# EasyEDA Pro project GPIO_Button_Grove_MOSFET_LED.epro

# Schematic GPIO_Button_Grove_MOSFET_LED

## Sheets
1 GPIO_Push-Button_or_Switch_Input
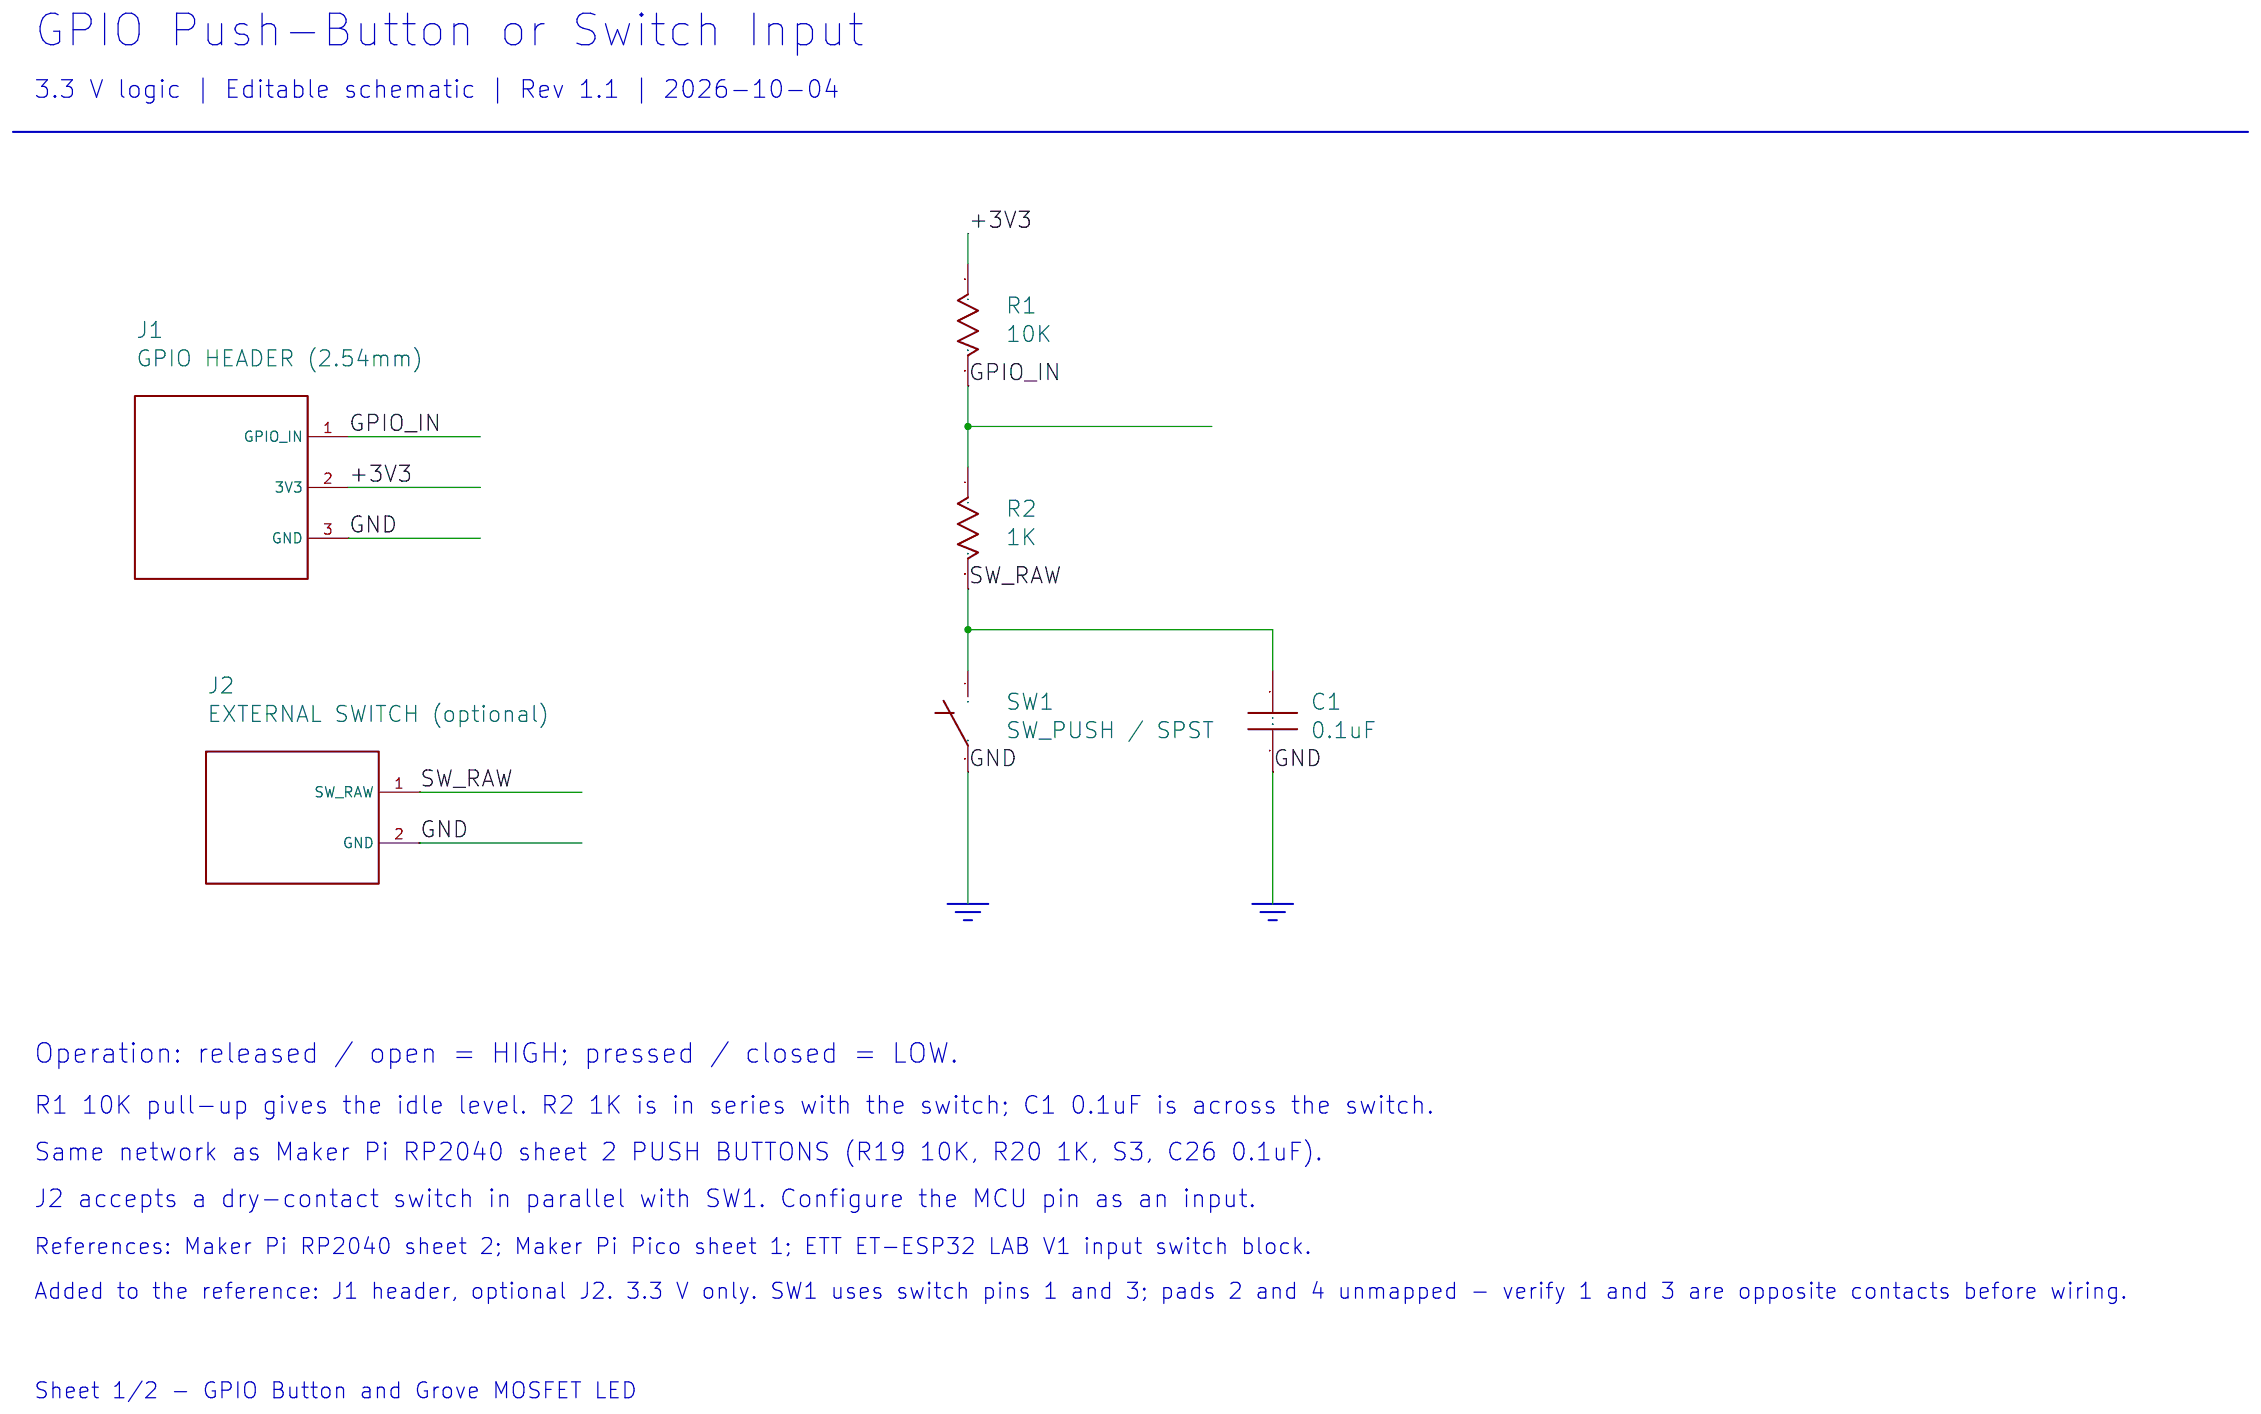
[diagram p0: GPIO_Push-Button_or_Switch_Input]
2 GROVE_4P_Button_MOSFET_LED
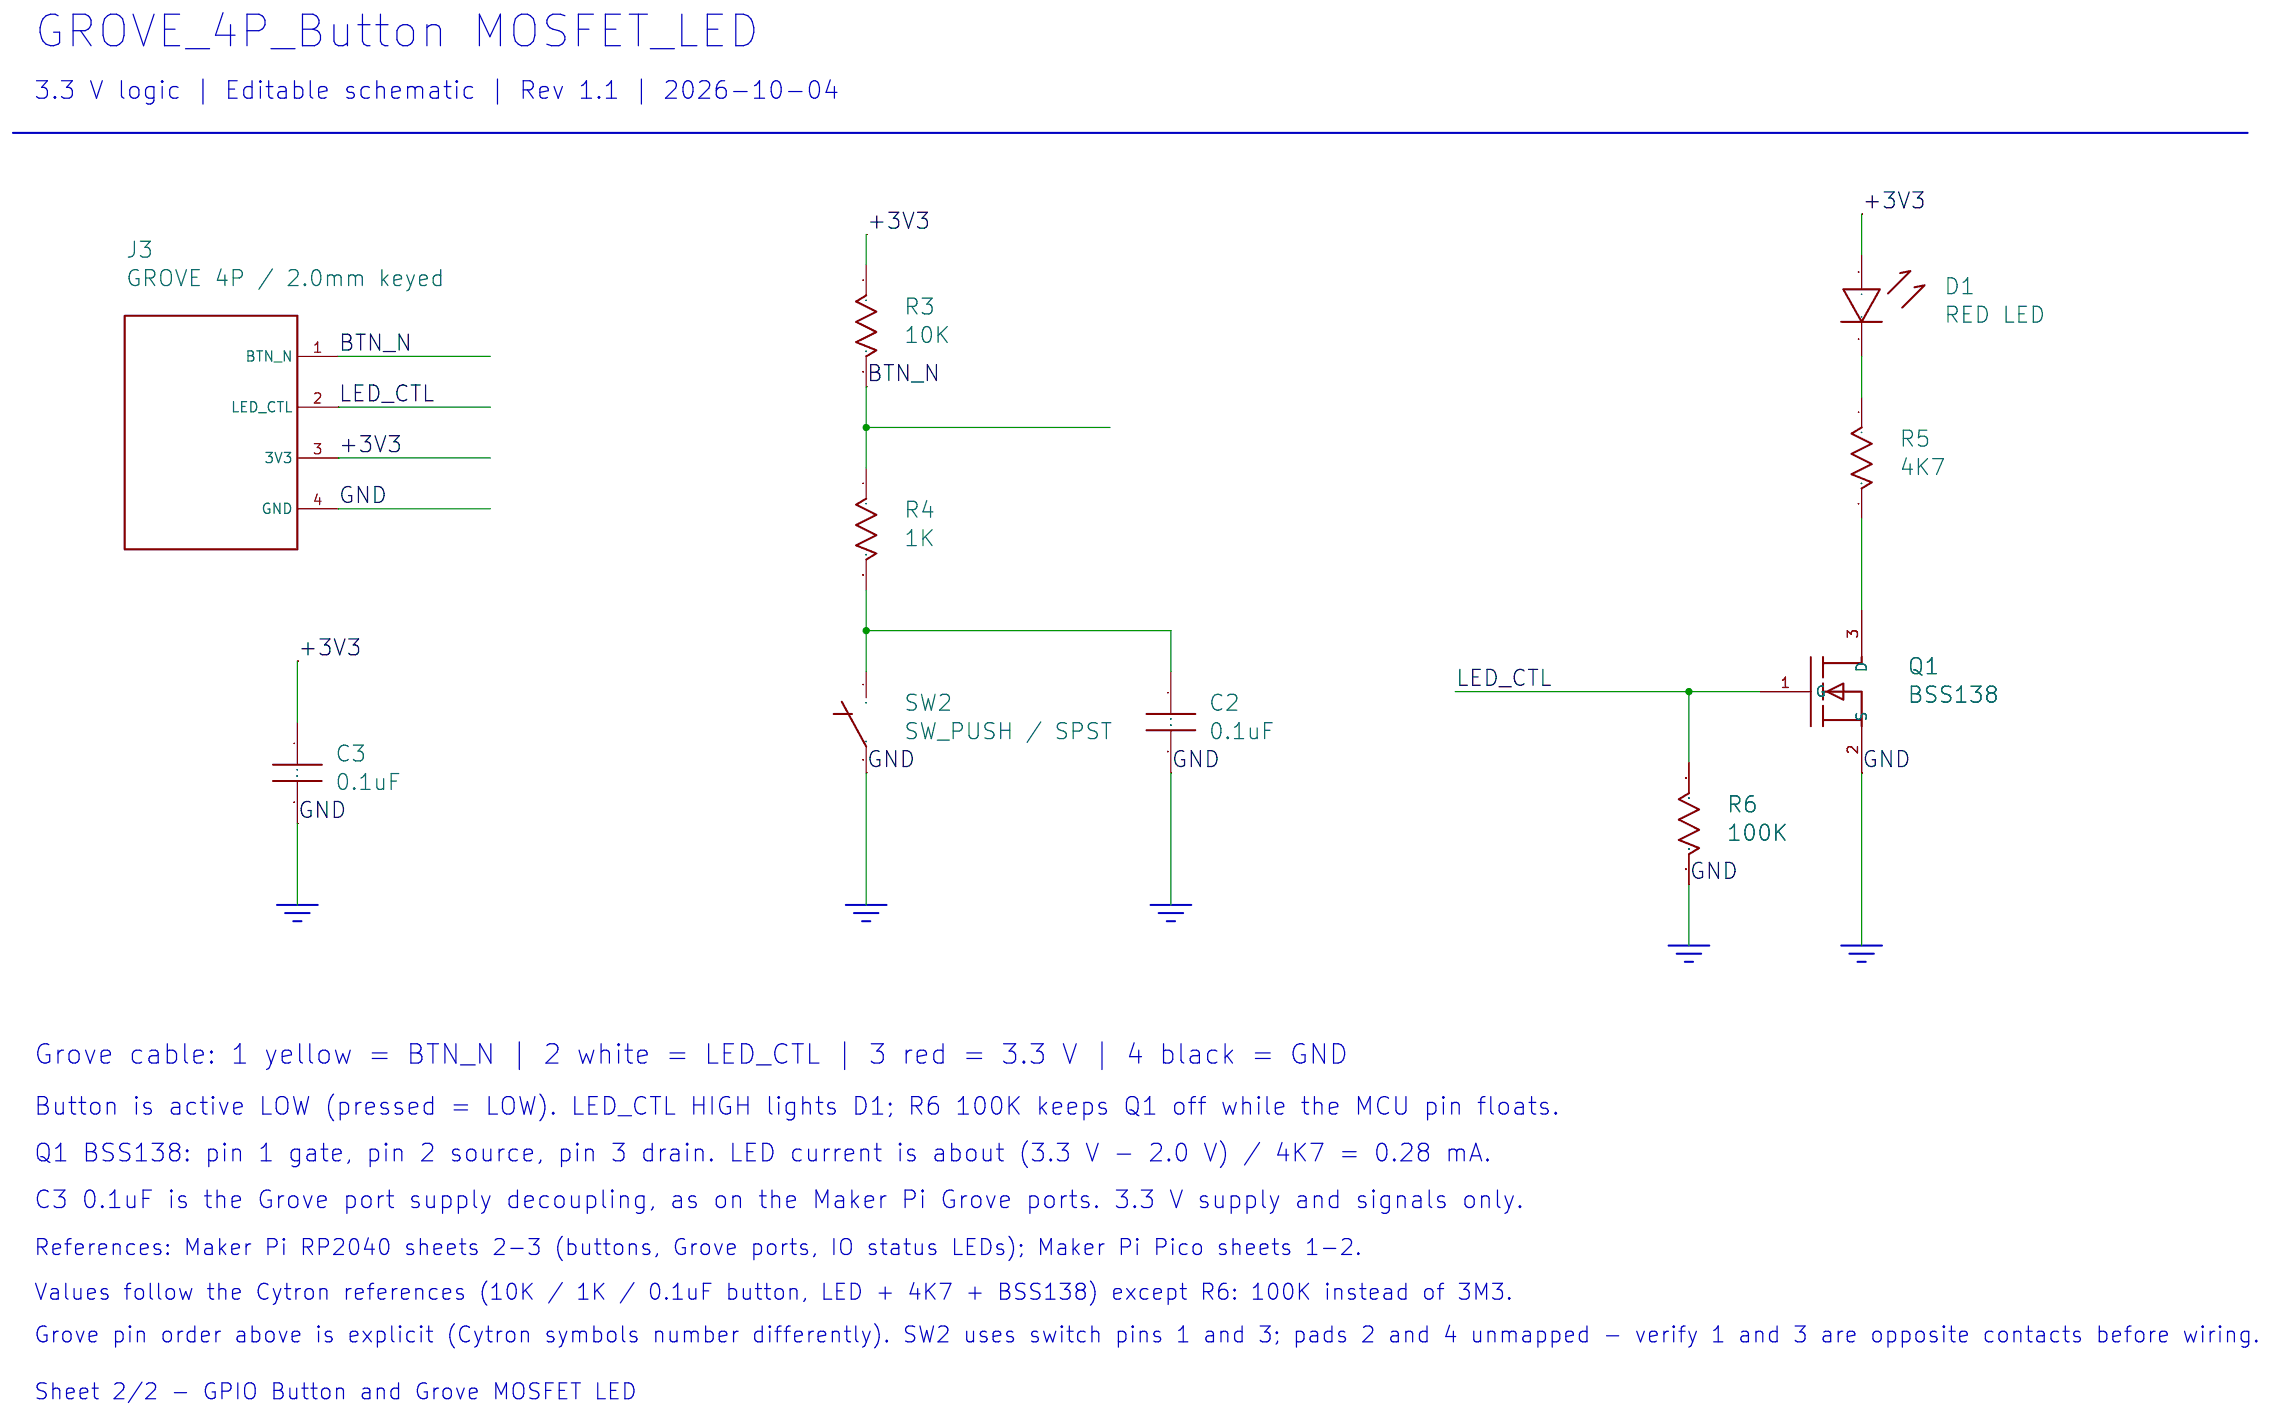
[diagram p1: GROVE_4P_Button_MOSFET_LED]

## Parts
sheet GPIO_Push-Button_or_Switch_Input
C1  0.1uF  [C0603]
J1  GPIO HEADER (2.54mm)  [HDR-TH_3P-P2.54-V-M]
J2  EXTERNAL SWITCH (optional)  [CONN-TH_B2B-XH-A-M]
R1  10K  [R0603]
R2  1K  [R0603]
SW1  SW_PUSH / SPST  [SW-TH_4P-L6.0-W6.0-P4.50-LS6.1]
sheet GROVE_4P_Button_MOSFET_LED
C2  0.1uF  [C0603]
C3  0.1uF  [C0603]
D1  RED LED  [LED0603]
J3  GROVE 4P / 2.0mm keyed  [CONN-TH_4P-P2.00_HC-HY2.0-4A-TW]
Q1  BSS138  [SOT-23-3_L2.9-W1.3-P0.92-LS2.4-BR]
R3  10K  [R0603]
R4  1K  [R0603]
R5  4K7  [R0603]
R6  100K  [R0603]
SW2  SW_PUSH / SPST  [SW-TH_4P-L6.0-W6.0-P4.50-LS6.1]

## Library data of the parts
C1-C3 = 0.1uF
J1 = GPIO HEADER (2.54mm)
J2 = EXTERNAL SWITCH (optional)
R1 R3 = 10K
R2 R4 = 1K
SW1 SW2 = SW_PUSH / SPST
D1 = RED LED
J3 = GROVE 4P / 2.0mm keyed
Q1 = BSS138
R5 = 4K7
R6 = 3M3

## Nets
+3V3: C3.1 D1.2(A) J1.2(3V3) J3.3(3V3) R1.1 R3.1
GND: C1.2 C2.2 C3.2 J1.3(GND) J2.2(GND) J3.4(GND) Q1.2(S) R6.2 SW1.2 SW2.2
BTN_N: J3.1(BTN_N) R3.2 R4.1
GPIO_IN: J1.1(GPIO_IN) R1.2 R2.1
LED_CTL: J3.2(LED_CTL) Q1.1(G) R6.1
SW_RAW: C1.1 J2.1(SW_RAW) R2.2 SW1.1
Net-(C2-1): C2.1 R4.2 SW2.1
Net-(D1-1): D1.1(K) R5.1
Net-(Q1-3): Q1.3(D) R5.2

## Notes on the sheets
sheet 1
- GPIO Push-Button or Switch Input
- 3.3 V logic | Editable schematic | Rev 1.1 | 2026-10-04
- Operation: released / open = HIGH; pressed / closed = LOW.
- R1 10K pull-up gives the idle level. R2 1K is in series with the switch; C1 0.1uF is across the switch.
- Same network as Maker Pi RP2040 sheet 2 PUSH BUTTONS (R19 10K, R20 1K, S3, C26 0.1uF).
- J2 accepts a dry-contact switch in parallel with SW1. Configure the MCU pin as an input.
- References: Maker Pi RP2040 sheet 2; Maker Pi Pico sheet 1; ETT ET-ESP32 LAB V1 input switch block.
- Added to the reference: J1 header, optional J2. 3.3 V only. SW1 uses switch pins 1 and 3; pads 2 and 4 unmapped - verify 1 and 3 are opposite contacts before wiring.
- Sheet 1/2 - GPIO Button and Grove MOSFET LED
sheet 2
- GROVE_4P_Button MOSFET_LED
- 3.3 V logic | Editable schematic | Rev 1.1 | 2026-10-04
- Grove cable: 1 yellow = BTN_N | 2 white = LED_CTL | 3 red = 3.3 V | 4 black = GND
- Button is active LOW (pressed = LOW). LED_CTL HIGH lights D1; R6 100K keeps Q1 off while the MCU pin floats.
- Q1 BSS138: pin 1 gate, pin 2 source, pin 3 drain. LED current is about (3.3 V - 2.0 V) / 4K7 = 0.28 mA.
- C3 0.1uF is the Grove port supply decoupling, as on the Maker Pi Grove ports. 3.3 V supply and signals only.
- References: Maker Pi RP2040 sheets 2-3 (buttons, Grove ports, IO status LEDs); Maker Pi Pico sheets 1-2.
- Values follow the Cytron references (10K / 1K / 0.1uF button, LED + 4K7 + BSS138) except R6: 100K instead of 3M3.
- Grove pin order above is explicit (Cytron symbols number differently). SW2 uses switch pins 1 and 3; pads 2 and 4 unmapped - verify 1 and 3 are opposite contacts before wiring.
- Sheet 2/2 - GPIO Button and Grove MOSFET LED
